# Altium schematic sheet ACQ.SchDoc
size A3; DocumentNumber: 2; SheetNumber: 2; SheetTotal: 4
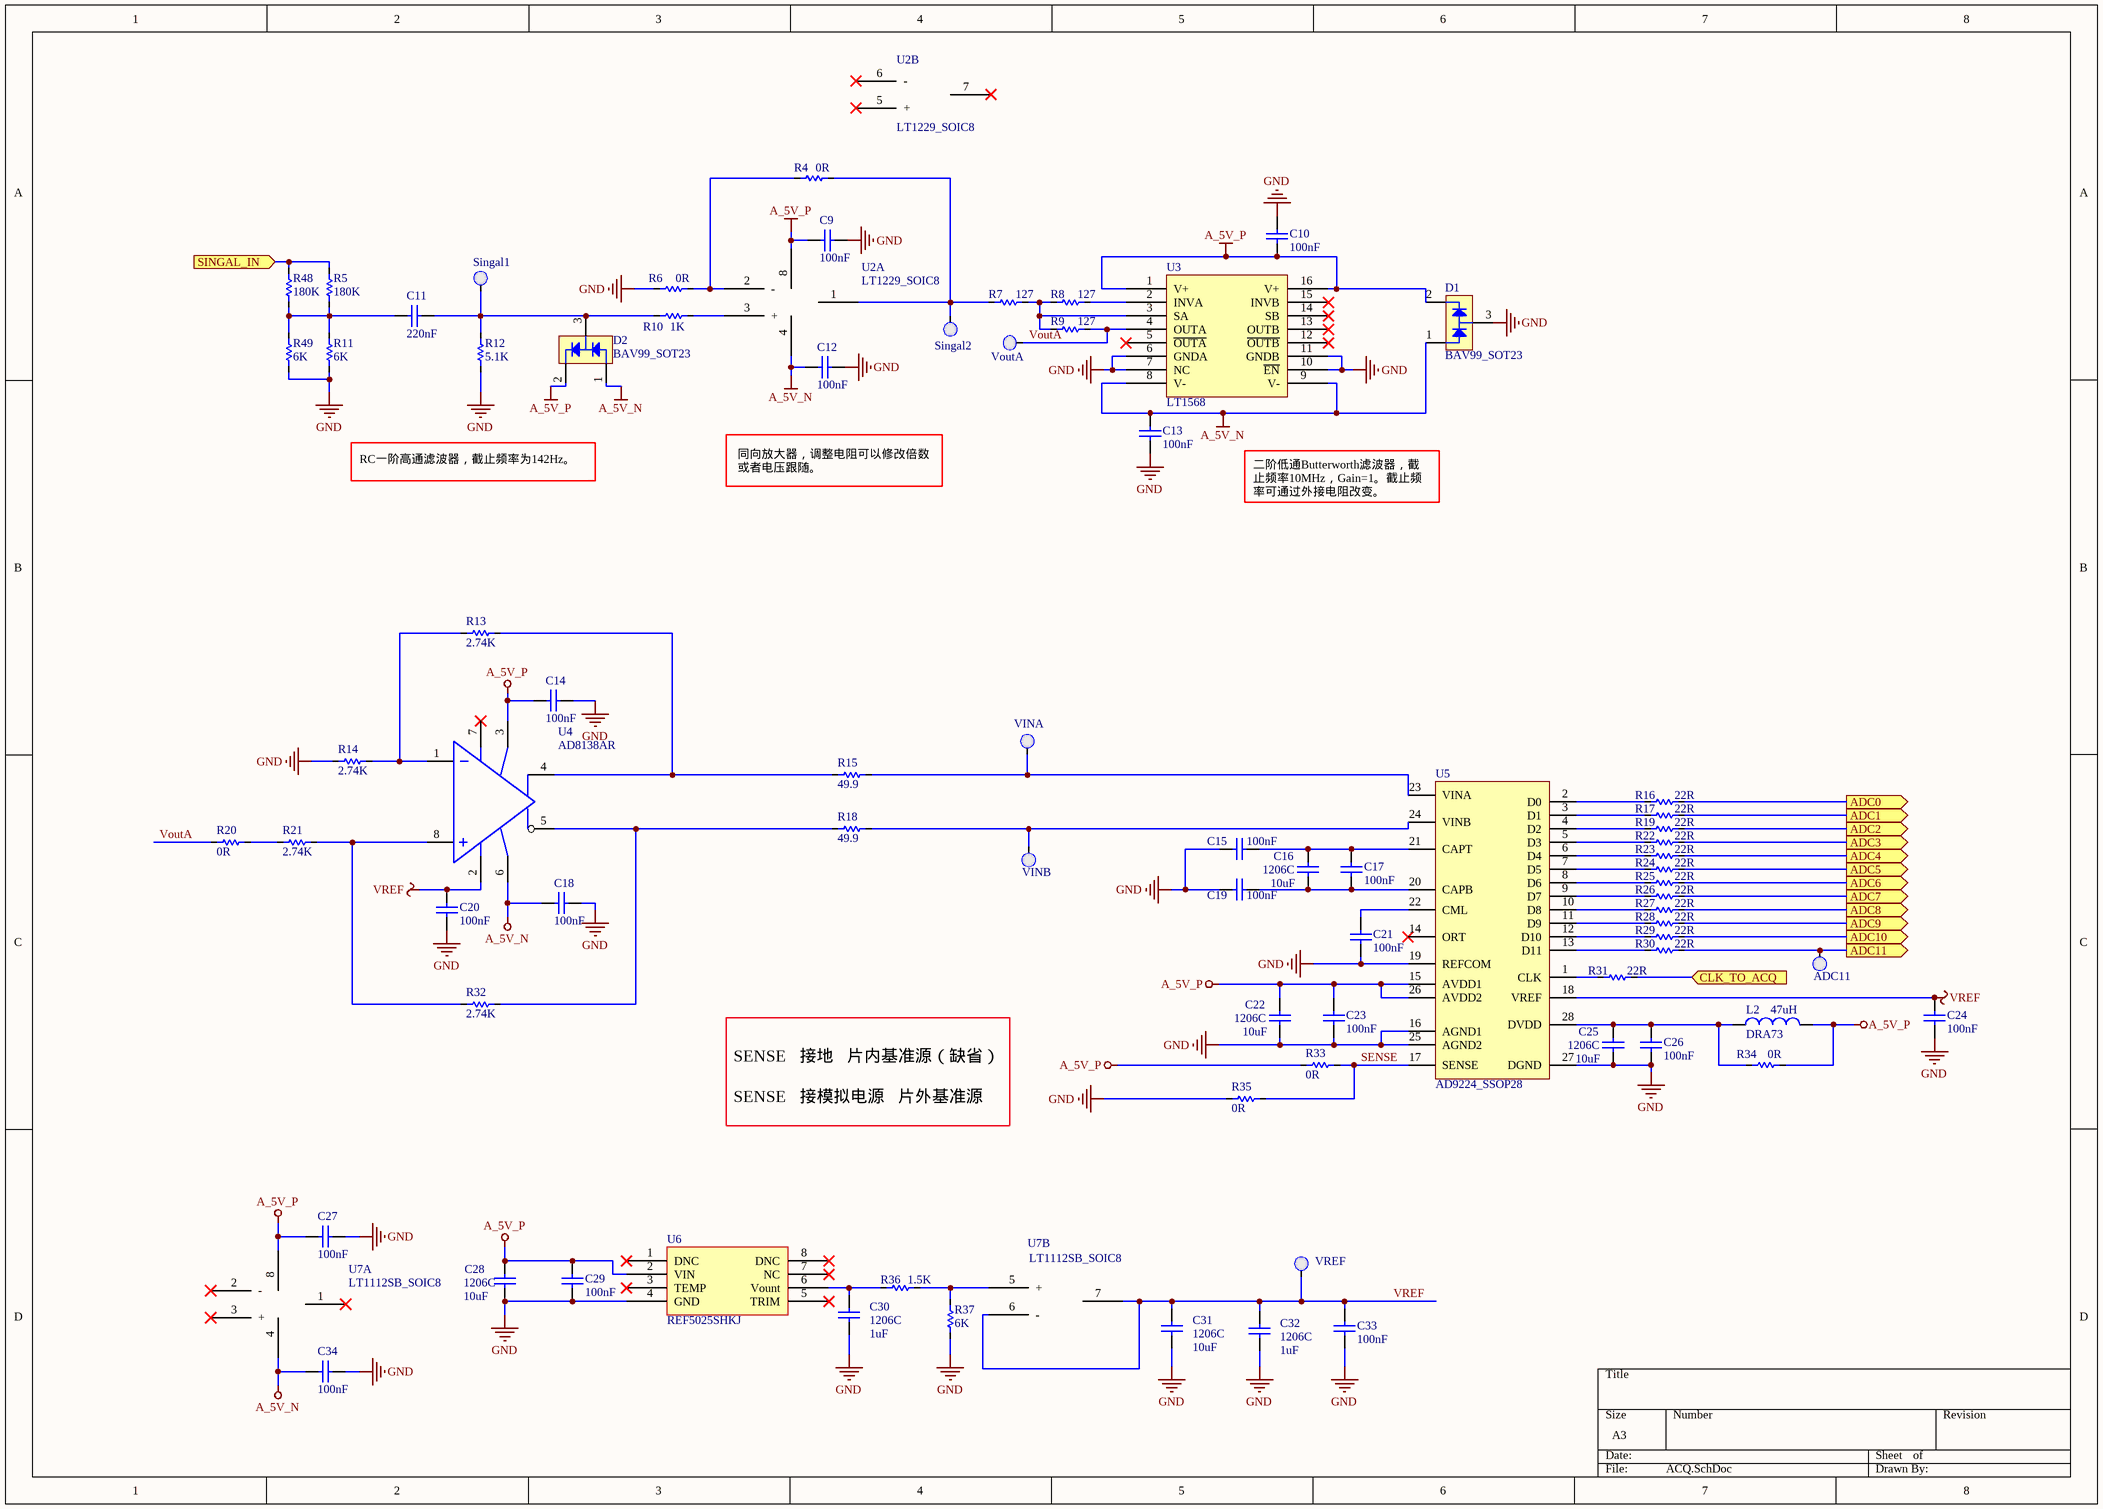
[diagram p0: ACQ.SchDoc]

## Parts
ADC11  TP  [TPA]  (value not drawn)
C9  100nF  [0805C]
C10  100nF  [0805C]
C11  220nF  [0805C]
C12  100nF  [0805C]
C13  100nF  [0805C]
C14  100nF  [0805C]
C15  100nF  [0805C]
C16  10uF  [1206C]
C17  100nF  [0805C]
C18  100nF  [0805C]
C19  100nF  [0805C]
C20  100nF  [0805C]
C21  100nF  [0805C]
C22  10uF  [1206C]
C23  100nF  [0805C]
C24  100nF  [0805C]
C25  10uF  [1206C]
C26  100nF  [0805C]
C27  100nF  [0805C]
C28  10uF  [1206C]
C29  100nF  [0805C]
C30  1uF  [1206C]
C31  10uF  [1206C]
C32  1uF  [1206C]
C33  100nF  [0805C]
C34  100nF  [0805C]
D1  BAV99_SOT23  [SOT23-3N]
D2  BAV99_SOT23  [SOT23-3N]
L2  DRA73  value 47uH  [INDP7676X35N]
R4  0R  [0805R]
R5  180K  [0805R]
R6  0R  [0805R]
R7  127  [0805R]
R8  127  [0805R]
R9  127  [0805R]
R10  1K  [0805R]
R11  6K  [0805R]
R12  5.1K  [0805R]
R13  2.74K  [0805R]
R14  2.74K  [0805R]
R15  49.9  [0805R]
R16  22R  [0805R]
R17  22R  [0805R]
R18  49.9  [0805R]
R19  22R  [0805R]
R20  0R  [0805R]
R21  2.74K  [0805R]
R22  22R  [0805R]
R23  22R  [0805R]
R24  22R  [0805R]
R25  22R  [0805R]
R26  22R  [0805R]
R27  22R  [0805R]
R28  22R  [0805R]
R29  22R  [0805R]
R30  22R  [0805R]
R31  22R  [0805R]
R32  2.74K  [0805R]
R33  0R  [0805R]
R34  0R  [0805R]
R35  0R  [0805R]
R36  1.5K  [0805R]
R37  6K  [0805R]
R48  180K  [0805R]
R49  6K  [0805R]
Singal1  TP  [TPA]  (value not drawn)
Singal2  TP  [TPA]  (value not drawn)
U2  LT1229_SOIC8  [SO-8]  (parts A,B of 2)
U3  LT1568  [SSOP16]
U4  AD8138AR  [SO-8]
U5  AD9224_SSOP28  [TSSOP28]
U6  REF5025SHKJ  [SO8-HKJ]
U7  LT1112SB_SOIC8  [SO-8]  (parts A,B of 2)
VINA  TP  [TPA]  (value not drawn)
VINB  TP  [TPA]  (value not drawn)
VoutA  TP  [TPA]  (value not drawn)
VREF  TP  [TPA]  (value not drawn)

## Ports
ADC0 (out), ADC1 (out), ADC2 (out), ADC3 (out), ADC4 (out), ADC5 (out), ADC6 (out), ADC7 (out), ADC8 (out), ADC9 (out), ADC10 (out), ADC11 (out), CLK_TO_ACQ (in), SINGAL_IN (in)

## Nets
A_5V_N: C12.2 C13.2 C18.1 C34.2 D1.1 D2.1 U2.4 U3.8(V-) U3.9(V-) U4.6(V-) U7.4
A_5V_P: C9.2 C10.1 C14.1 C22.2 C23.1 C27.1 C28.2 C29.1 D1.2 D2.2 L2.2 R33.2 R34.1 U2.8 U3.1(V+) U3.16(V+) U4.3(V+) U5.15(AVDD1) U5.26(AVDD2) U6.2(VIN) U7.8
GND: C9.1 C10.2 C12.1 C13.1 C14.2 C15.1 C18.2 C19.1 C20.2 C21.2 C22.1 C23.2 C24.2 C25.1 C26.2 C27.2 C28.1 C29.2 C30.1 C31.1 C32.1 C33.2 C34.1 D1.3 R6.2 R11.1 R12.1 R14.2 R35.2 R37.1 R49.1 U3.6(GNDA) U3.7(NC) U3.10(~{EN}) U3.11(GNDB) U5.16(AGND1) U5.19(REFCOM) U5.25(AGND2) U5.27(DGND) U6.4(GND)
VREF: C20.1 C24.1 C31.2 C32.2 C33.1 U4.2(Vcom) U5.18(VREF) U7.6(-) U7.7(OUTB) VREF.1(TP)
ADC0: R16.1 ; port ADC0
ADC1: R17.1 ; port ADC1
ADC2: R19.1 ; port ADC2
ADC3: R22.1 ; port ADC3
ADC4: R23.1 ; port ADC4
ADC5: R24.1 ; port ADC5
ADC6: R25.1 ; port ADC6
ADC7: R26.1 ; port ADC7
ADC8: R27.1 ; port ADC8
ADC9: R28.1 ; port ADC9
ADC10: R29.1 ; port ADC10
ADC11: ADC11.1(TP) R30.1 ; port ADC11
CLK_TO_ACQ: R31.1 ; port CLK_TO_ACQ
SENSE: R33.1 R35.1 U5.17(SENSE)
SINGAL_IN: R5.2 R48.2 ; port SINGAL_IN
VoutA: R9.2 R20.2 U3.4(OUTA) VoutA.1(TP)
NetC11_1: C11.1 D2.3 R10.2 R12.2 Singal1.1(TP)
NetC11_2: C11.2 R5.1 R11.2 R48.1 R49.2
NetC15_2: C15.2 C16.2 C17.1 U5.21(CAPT)
NetC16_1: C16.1 C17.2 C19.2 U5.20(CAPB)
NetC21_1: C21.1 U5.22(CML)
NetC25_2: C25.2 C26.1 L2.1 R34.2 U5.28(DVDD)
NetC30_2: C30.2 R36.1 U6.6(Vount)
NetR4_1: R4.1 R7.1 Singal2.1(TP) U2.1(OUTA)
NetR4_2: R4.2 R6.1 U2.2(-)
NetR7_2: R7.2 R8.1 R9.1 U3.3(SA)
NetR8_2: R8.2 U3.2(INVA)
NetR10_1: R10.1 U2.3(+)
NetR13_1: R13.1 R15.2 U4.4(OUT+)
NetR13_2: R13.2 R14.1 U4.1(Din-)
NetR15_1: R15.1 U5.23(VINA) VINA.1(TP)
NetR16_2: R16.2 U5.2(D0)
NetR17_2: R17.2 U5.3(D1)
NetR18_1: R18.1 U5.24(VINB) VINB.1(TP)
NetR18_2: R18.2 R32.1 U4.5(OUT-)
NetR19_2: R19.2 U5.4(D2)
NetR20_1: R20.1 R21.2
NetR21_1: R21.1 R32.2 U4.8(Din+)
NetR22_2: R22.2 U5.5(D3)
NetR23_2: R23.2 U5.6(D4)
NetR24_2: R24.2 U5.7(D5)
NetR25_2: R25.2 U5.8(D6)
NetR26_2: R26.2 U5.9(D7)
NetR27_2: R27.2 U5.10(D8)
NetR28_2: R28.2 U5.11(D9)
NetR29_2: R29.2 U5.12(D10)
NetR30_2: R30.2 U5.13(D11)
NetR31_2: R31.2 U5.1(CLK)
NetR36_2: R36.2 R37.2 U7.5(+)

Not connected (* = marked no-connect by the designer): U2 5(+)* 6(-)* 7(OUTB)*; U3 5(~{OUTA})* 12(~{OUTB})* 13(OUTB)* 14(SB)* 15(INVB)*; U4 7(NC)*; U5 14(ORT)*; U6 1(DNC)* 3(TEMP)* 5(TRIM)* 7(NC)* 8(DNC)*; U7 1(OUTA)* 2(-)* 3(+)*

## Notes on the sheet
- RC一阶高通滤波器，截止频率为142Hz。
- 同向放大器，调整电阻可以修改倍数或者电压跟随。
- 二阶低通Butterworth滤波器，截止频率10MHz，Gain=1。截止频率可通过外接电阻改变。
- SENSE   接地   片内基准源（缺省）
- SENSE   接模拟电源   片外基准源

## Library data of the parts
C9-C34 = Cap: Capacitor; Published: 8-Jun-2000; LatestRevisionDate: 17-Jul-2002; LatestRevisionNote: Re-released for DXP Platform.; Publisher: Altium Limited; PackageDescription: Radial Cap, Thru-Hole; 2 Leads; 0.3 in Pin Spacing
  C9 C10 C12-C15 C17-C21 C23 C24 C26 C27 C29 C33 C34: PackageReference: RAD-0.3; Value: 100nF
  C11: PackageReference: RAD-0.3; Value: 220nF
  C16 C22 C25 C28 C31: PackageReference: 1206C; Value: 10uF
  C30 C32: PackageReference: 1206C; Value: 1uF
D1 D2 = BAV99LT1
L2 = Inductor
R4-R37 R48 R49 = Res1: Resistor; Published: 8-Jun-2000; LatestRevisionDate: 17-Jul-2002; LatestRevisionNote: Re-released for DXP Platform.; PackageReference: AXIAL-0.3; Publisher: Altium Limited; PackageDescription: Axial Device, Thru-Hole; 2 Leads; 0.3 in Pin Spacing
  R4 R6 R20 R33-R35: Value: 0R
  R5 R48: Value: 180K
  R7-R9: Value: 127
  R10: Value: 1K
  R11 R37 R49: Value: 6K
  R12: Value: 5.1K
  R13 R14 R21 R32: Value: 2.74K
  R15 R18: Value: 49.9
  R16 R17 R19 R22-R31: Value: 22R
  R36: Value: 1.5K
U2 U7 = AD827
U5 = AD9224